# Altium schematic sheet CS4334_V4.SchDoc
size A; SheetNumber: 1; SheetTotal: 1
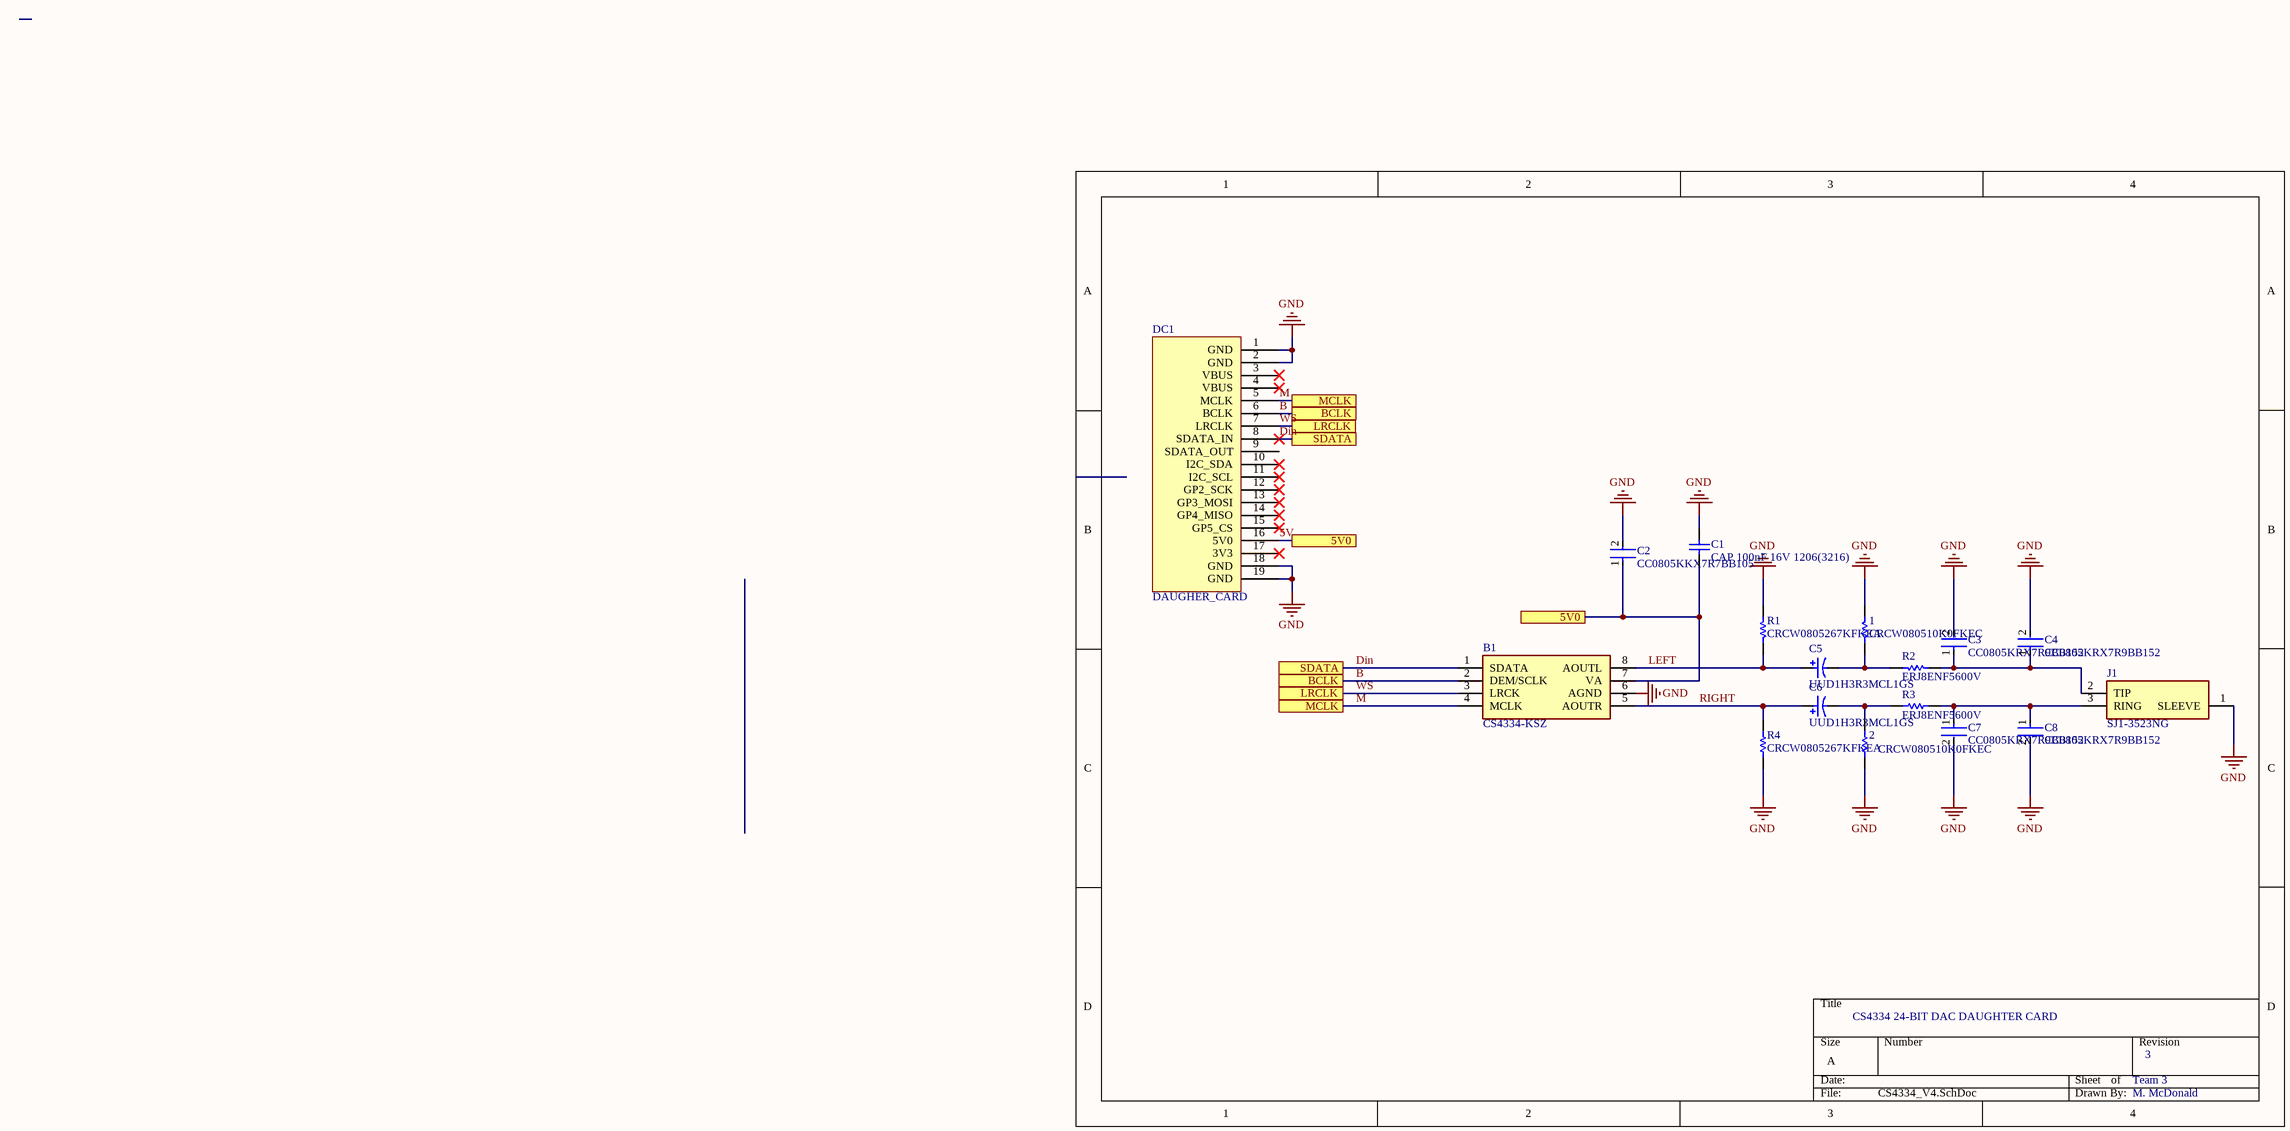
[diagram p0: CS4334_V4.SchDoc]

## Parts
1  CRCW080510K0FKEC  [RESC2013X50X30ML20T20]
2  CRCW080510K0FKEC  [RESC2013X50X30ML20T20]
B1  CS4334-KSZ  [SOIC127P600X175-8N]
C1  CAP 100nF 16V 1206(3216)  [CAPC1206(3216)100_L]
C2  CC0805KKX7R7BB105  [FP-CC0805-0_85-MFG]
C3  CC0805KRX7R9BB152  [FP-CC0805-0_85-MFG]
C4  CC0805KRX7R9BB152  [FP-CC0805-0_85-MFG]
C5  UUD1H3R3MCL1GS  [NIC-CAPA2-4X5.8_V]
C6  UUD1H3R3MCL1GS  [NIC-CAPA2-4X5.8_V]
C7  CC0805KRX7R9BB152  [FP-CC0805-0_85-MFG]
C8  CC0805KRX7R9BB152  [FP-CC0805-0_85-MFG]
DC1  DAUGHER_CARD  [Daughter_Card]
J1  SJ1-3523NG  [SJ13523NG]
R1  CRCW0805267KFKEA  [RESC2013X50X30ML20T20]
R2  ERJ8ENF5600V  [RESC3216X70X50LL05T20]
R3  ERJ8ENF5600V  [RESC3216X70X50LL05T20]
R4  CRCW0805267KFKEA  [RESC2013X50X30ML20T20]

## Ports
5V0, BCLK, LRCLK, MCLK, SDATA

## Nets
GND: 1.2 2.2 B1.6(AGND) C1.1 C2.2 C3.2 C4.2 C7.2 C8.2 DC1.1(GND) DC1.2(GND) DC1.18(GND) DC1.19(GND) J1.1(SLEEVE) R1.1 R4.1
5V: B1.7(VA) C1.2 C2.1 DC1.16(5V0) ; port 5V0
B: B1.2(DEM/SCLK) DC1.6(BCLK) ; port BCLK
Din: B1.1(SDATA) DC1.8(SDATA_IN) ; port SDATA
LEFT: B1.8(AOUTL) C5.1 R1.2
M: B1.4(MCLK) DC1.5(MCLK) ; port MCLK
RIGHT: B1.5(AOUTR) C6.1 R4.2
WS: B1.3(LRCK) DC1.7(LRCLK) ; port LRCLK
Net1_1: 1.1 C5.2 R2.1
Net2_1: 2.1 C6.2 R3.1
NetC3_1: C3.1 C4.1 J1.2(TIP) R2.2
NetC7_1: C7.1 C8.1 J1.3(RING) R3.2

Not connected (* = marked no-connect by the designer): DC1 3(VBUS)* 4(VBUS)* 9(SDATA_OUT) 10(I2C_SDA)* 11(I2C_SCL)* 12(GP2_SCK)* 13(GP3_MOSI)* 14(GP4_MISO)* 15(GP5_CS)* 17(3V3)*

## Notes on the sheet
- CS4334 24-BIT DAC DAUGHTER CARD
- Team 3
- 3
- M. McDonald

## Library data of the parts
1 2 = CMP-1013-00623-2: Manufacturer: Vishay Dale; Part Number: CRCW080510K0FKEC
B1 = CS4334-KSZ: CS4334-KSZ, Audio DAC Dual 24 bit-, 96ksps +/-5%FSR Serial, 8-Pin SOIC; Manufacturer_Name: Cirrus Logic; Geometry.Height: 1.75mm; Mouser Part Number: 777-CS4334-KSZ; Mouser Price/Stock: https://www.mouser.co.uk/ProductDetail/Cirrus-Logic/CS4334-KSZ?qs=bUPhaerQQeGFS7Qn8B%252B25A%3D%3D; Manufacturer_Part_Number: CS4334-KSZ; Datasheet Link: https://d3uzseaevmutz1.cloudfront.net/pubs/proDatasheet/CS4334-5-8-9_F7.pdf
C1 = CMP-1037-04182-1: CAP 100nF 16V ±10% 1206 (3216 Metric) Thickness 1mm SMD; Tolerance: Â±10%; Case-EIA: 1206; Case-Metric: 3216; Rated Voltage: 16 V; Value: 100nF; Max Thickness: 1 mm; Technology: SMT
C2 = CMP-03422-000001-1: CAP CER 1UF 16V X7R 0805; Manufacturer: Yageo; Material: Ceramic; Tolerance: 0.1; Voltage Rating: 16 V; Category: Cap; Capacitance: 1 uF; ComponentLink2Description: Datasheet; Automotive: No; Temperature Range High: +85°C; RoHS: TRUE; Footprint Url: http://www.yageo.com/exep/pages/download/literatures/UPY-C_GEN_24.pdf; Mouser Description: Multilayer Ceramic Capacitors MLCC - SMD/SMT 1.0uF 16V X7R 10%; Height: 0.95mm; Ipc Land Pattern Name: CAPC200125X85; Temperature: -30°C to +85°C; Lead Free: Yes; Value: 1 uF; Temperature Characteristic: X7R; Package: CC0805-0.85; Temperature Range Low: -30°C; Device Class L1: Passive Components; Device Class L3: Ceramic Capacitors; Octopart: https://octopart.com/cc0805kkx7r7bb105-yageo-8376555; Manufacturer Part Number: CC0805KKX7R7BB105; ComponentLink2URL: http://www.yageo.com/documents/recent/UPY-GPHC_Y5V_6.3V-to-50V_8.pdf; Device Class L2: Capacitors; Digikey Description: CAP CER 1UF 16V X7R 0805
C3 C4 C7 C8 = CMP-1036-03122-2: CAP CER 1500PF 50V X7R 0805; Manufacturer: Yageo; Value: 1.5 nF; Tolerance: 0.1; Material: Ceramic; Octopart: https://octopart.com/cc0805krx7r9bb152-yageo-39467749; Device Class L3: Ceramic Capacitors; Height: 0.95mm; Digikey Description: CAP CER 1500PF 50V X7R 0805; Temperature: -30°C to +85°C; Temperature Range Low: -30°C; ComponentLink2Description: Datasheet; Capacitance: 1.5 nF; Mouser Description: Multilayer Ceramic Capacitors MLCC - SMD/SMT 1.5nF 50V X7R 10%; Temperature Characteristic: X7R; Temperature Range High: +85°C; Lead Free: Yes; Manufacturer Part Number: CC0805KRX7R9BB152; Automotive: No; Footprint Url: http://www.yageo.com/exep/pages/download/literatures/UPY-C_GEN_24.pdf; ComponentLink2URL: http://www.yageo.com/documents/recent/UPY-GPHC_Y5V_6.3V-to-50V_8.pdf; RoHS: TRUE; Category: Cap; Voltage Rating: 50 V; Device Class L2: Capacitors; Device Class L1: Passive Components; Ipc Land Pattern Name: CAPC200125X85; Package: CC0805-0.85
C5 C6 = CMP-0687-00014-1: Aluminum Electrolytic Capacitor, UD Series, Low Impedance, 3.3 uF, 50 V, + / - 20%, -55 to 105 degC, Chip Type, 4 x 5.8 mm D x L, Pb-Free, Reel; Manufacturer: Nichicon; Endurance Time: 2000 h; Rated Ripple Current (at 100kHz): 30 mA; Packing: Dia382mm Reel; Rated Voltage: 50 V; Rated Capacitance: 3.3 uF; Impedance: 5 Ohm; Tolerance Rated Capacitance: -20 to 20%; ComponentLink2Description: Datasheet; PackageReference: CAPAE-D4H5.8; Length: 5.8 mm; ComponentLink1URL: http://www.nichicon.co.jp/; ComponentLink3Description: Package Specification; DatasheetVersion: 08/2012; PackageDescription: 2-Pin Surface Mount Device, Diameter 4 mm, Height 5.8 mm, Pitch 3.6 mm; RoHS: TRUE; ComponentLink3URL: http://products.nichicon.co.jp/en/pdf/XJA043/e-ud.pdf; PartNumber: UUD1H3R3MCL1GS; Diameter: 4 mm; ComponentLink1Description: Manufacturer URL; Mounting Technology: Surface Mount; ComponentLink2URL: http://products.nichicon.co.jp/en/pdf/XJA043/e-ud.pdf
J1 = SJ1-3523NG: Phone Connectors Audio Jacks 3.5 MM AUDIO JACK; Manufacturer_Name: CUI Devices; Geometry.Height: 5.6mm; Mouser Part Number: 490-SJ1-3523NG; Mouser Price/Stock: https://www.mouser.co.uk/ProductDetail/CUI-Devices/SJ1-3523NG?qs=WyjlAZoYn50Li0c1bXCgGA%3D%3D; Manufacturer_Part_Number: SJ1-3523NG; Datasheet Link: https://www.arrow.com/en/products/sj1-3523ng/cui-devices
R1 R4 = CMP-2001-03727-1: Manufacturer: Vishay Dale; Part Number: CRCW0805267KFKEA
R2 R3 = CMP-2003-00856-1: Manufacturer: Panasonic; Part Number: ERJ8ENF5600V